# EasyEDA Pro project ProPrj_ftdi-jtag-xilinx-14pin_2025-03-20_v2.1.epro, schematic Schematic1

## Sheets
1 FT2232HQ: Board Name: Board1; Create Date: 2025-03-20; Page Name: FT2232HQ; Project Name: ftdi-jtag-xilinx-14pin; Schematic Name: Schematic1; Update Date: 2025-03-20; Company: 嘉立创EDA; Page Size: A4; Version: V1.0
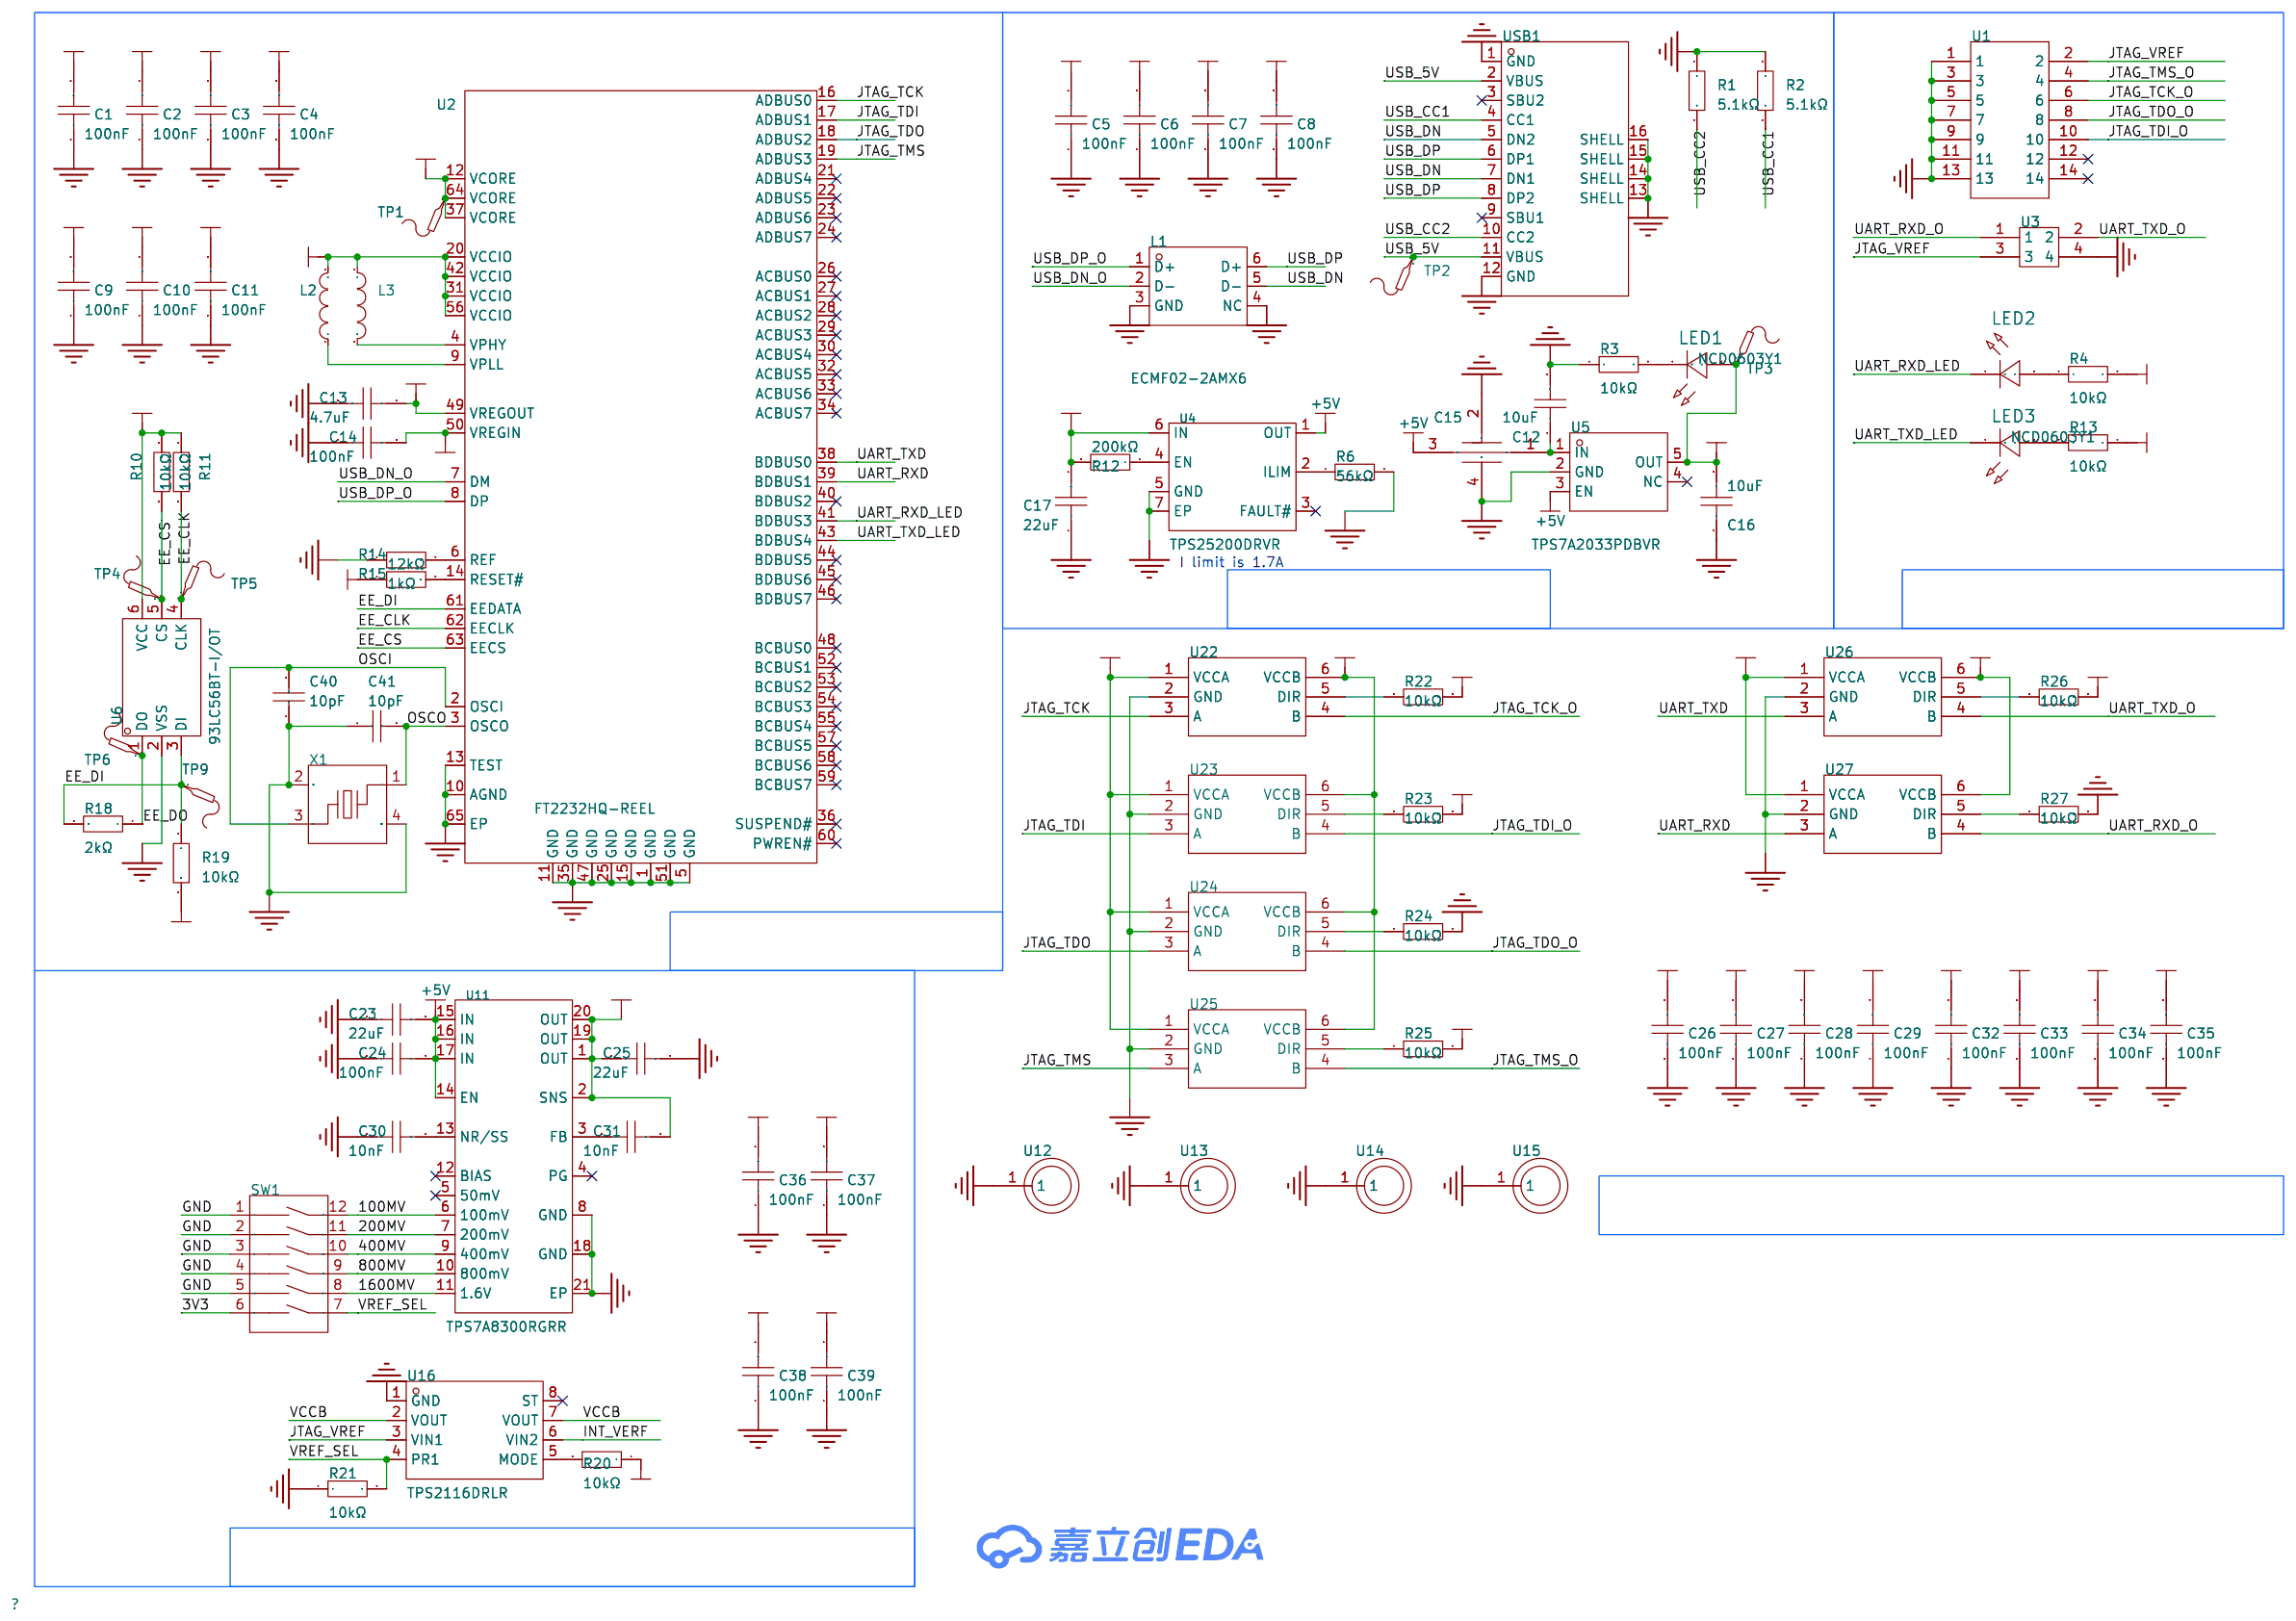
[diagram p0: FT2232HQ]
2 JTAG Adapter: Page Name: JTAG Adapter
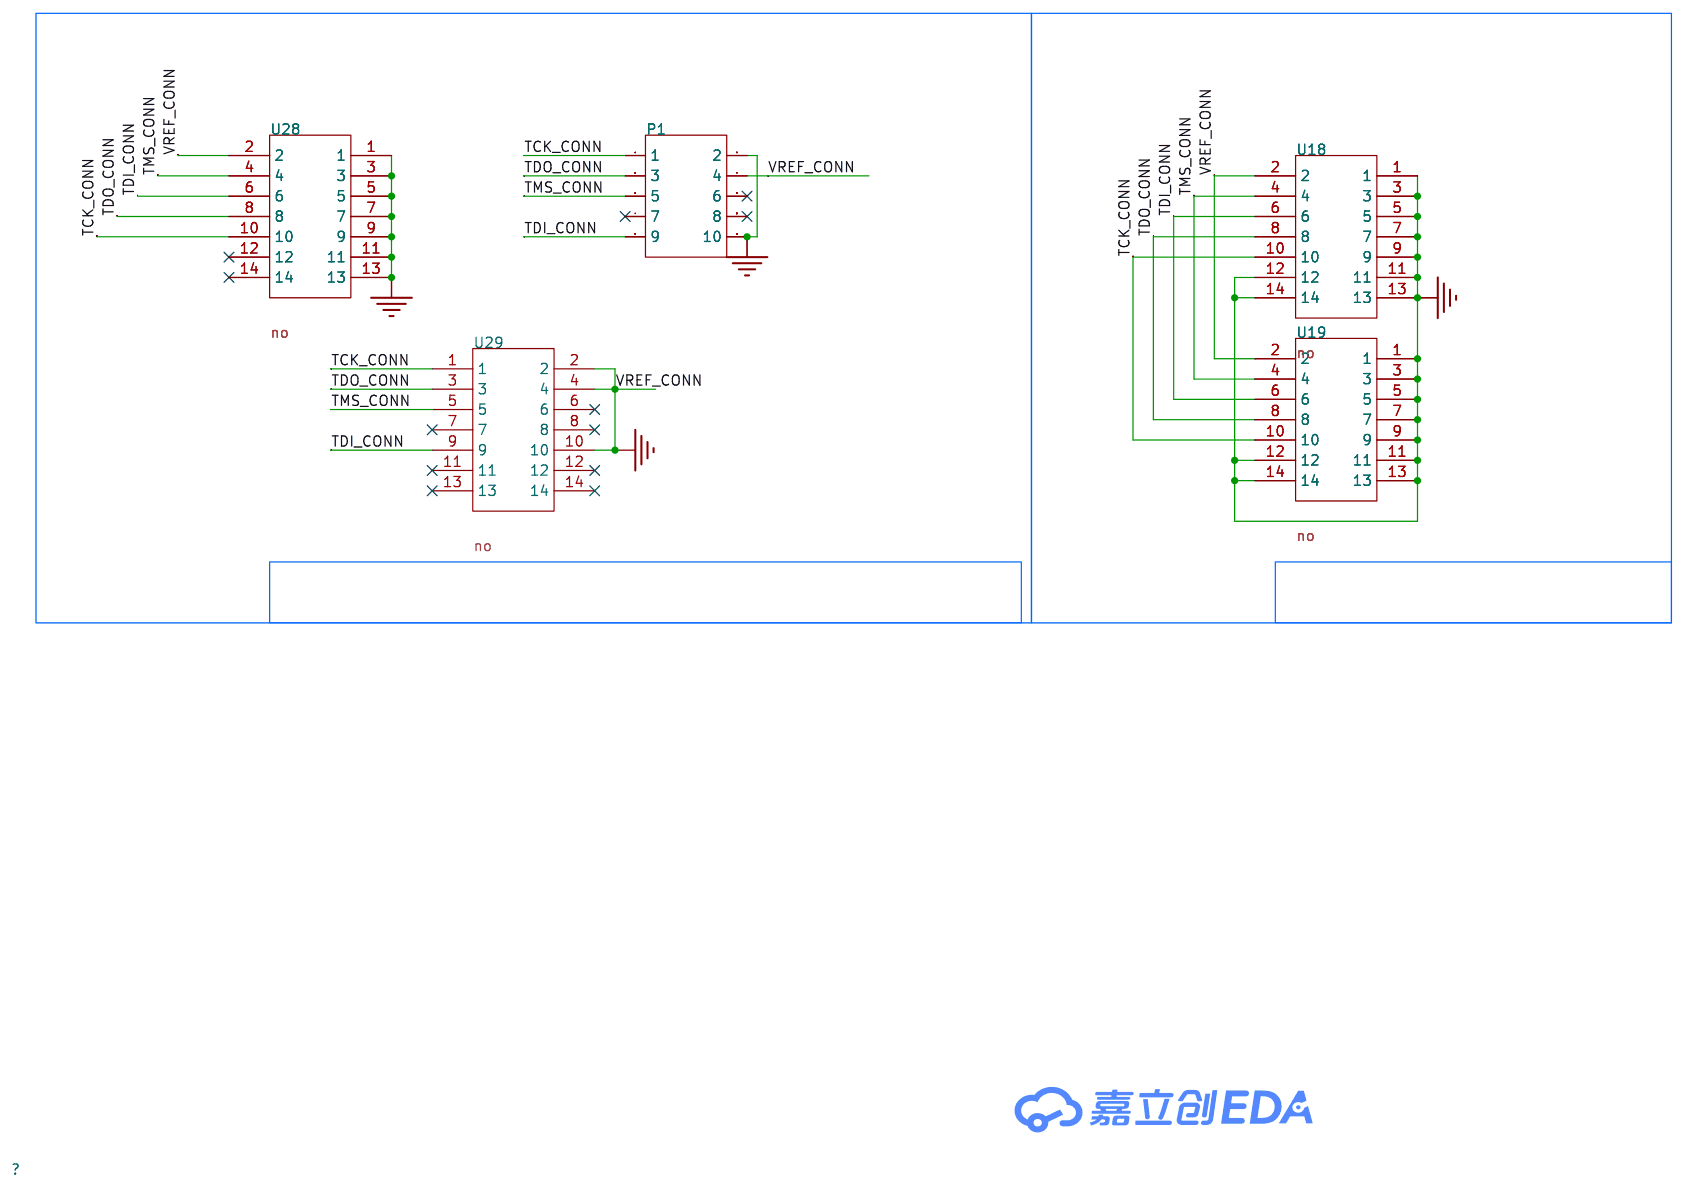
[diagram p1: JTAG Adapter]
3 Overview: Create Date: 2024-12-31; Page Name: Overview; Project Name: ftdi-jtag-xilinx; Update Date: 2024-12-31
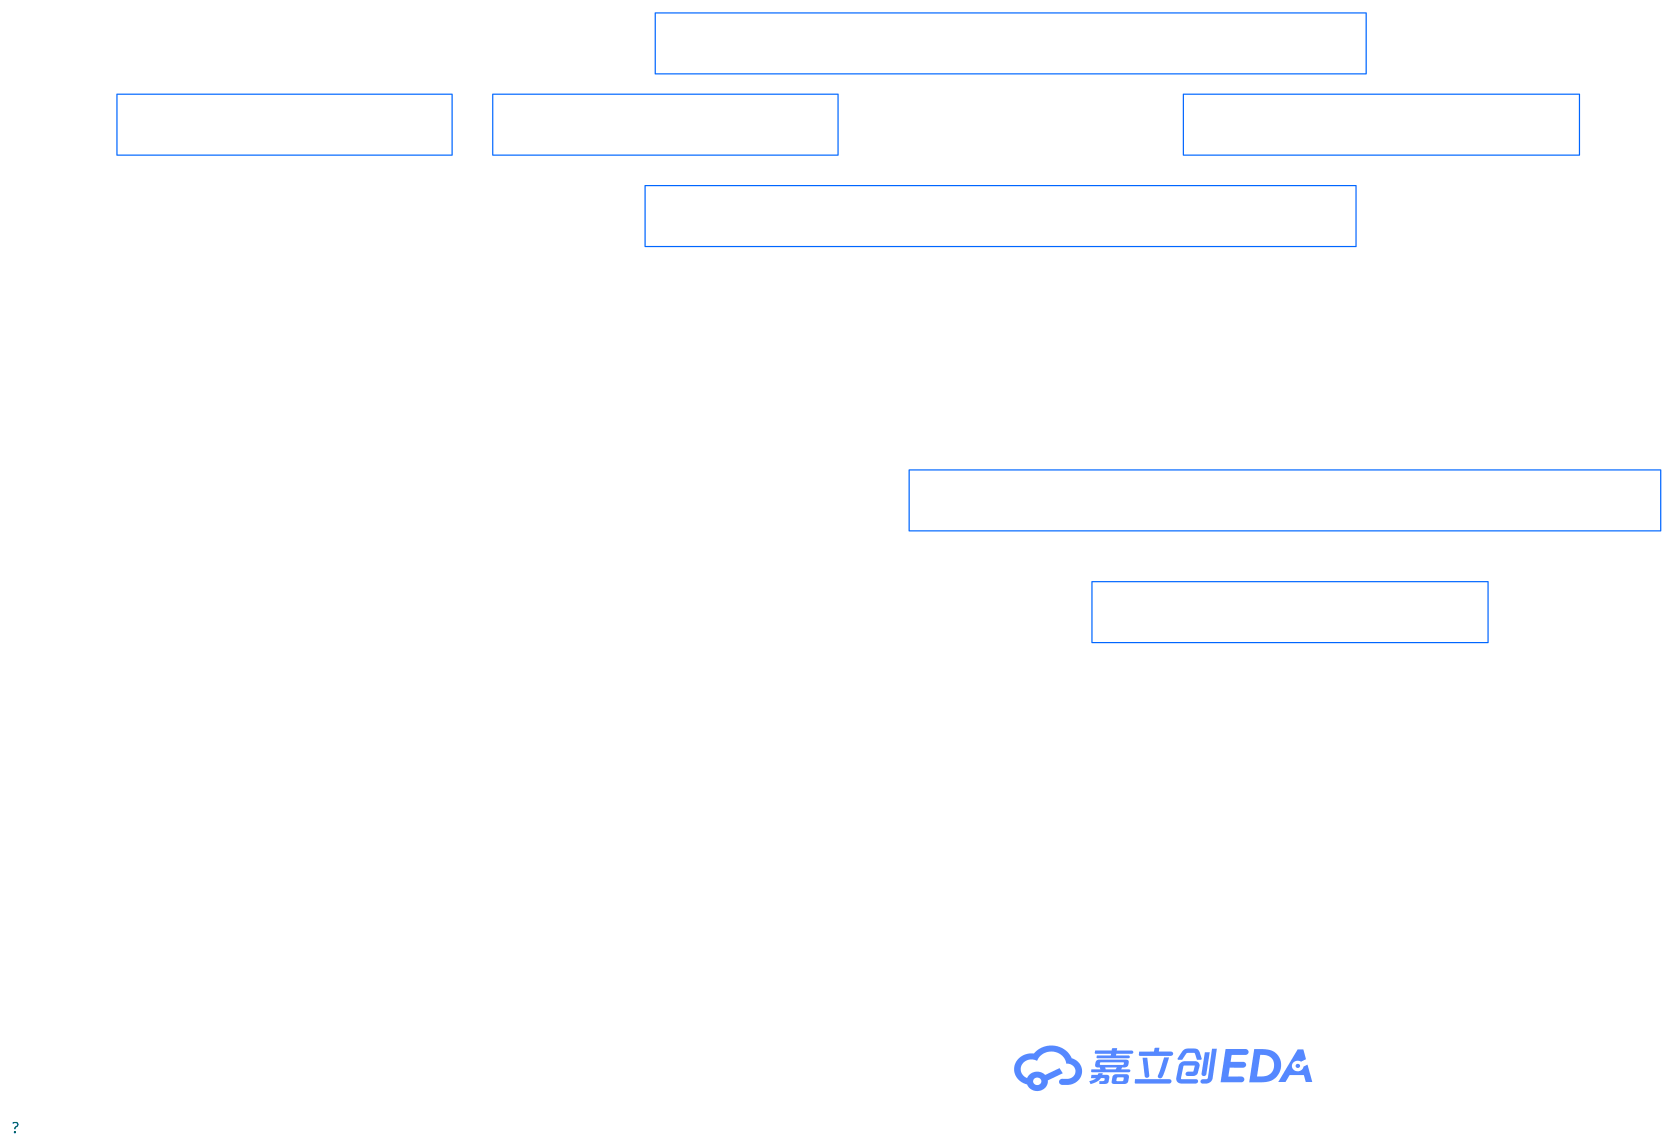
[diagram p2: Overview]
4 TVS: Page Name: TVS
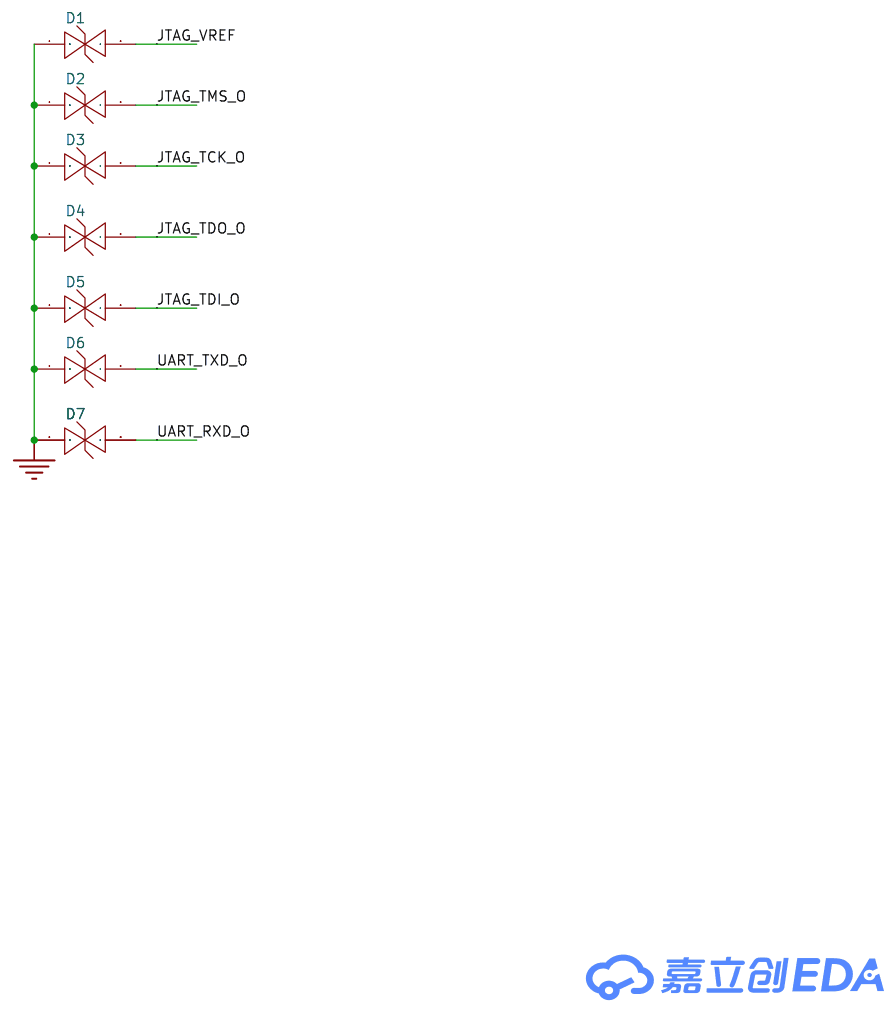
[diagram p3: TVS]

## Parts
sheet FT2232HQ
C1  100nF  [C0402]
C2  100nF  [C0402]
C3  100nF  [C0402]
C4  100nF  [C0402]
C5  100nF  [C0402]
C6  100nF  [C0402]
C7  100nF  [C0402]
C8  100nF  [C0402]
C9  100nF  [C0402]
C10  100nF  [C0402]
C11  100nF  [C0402]
C12  10uF  [C0603]
C13  4.7uF  [C0402]
C14  100nF  [C0402]
C15  NFM21PC104R1E3D  [CAP-SMD_4P-L2.0-W1.25]
C16  10uF  [C0603]
C17  22uF  [C0805]
C23  22uF  [C0805]
C24  100nF  [C0402]
C25  22uF  [C0805]
C26  100nF  [C0402]
C27  100nF  [C0402]
C28  100nF  [C0402]
C29  100nF  [C0402]
C30  10nF  [C0402]
C31  10nF  [C0402]
C32  100nF  [C0402]
C33  100nF  [C0402]
C34  100nF  [C0402]
C35  100nF  [C0402]
C36  100nF  [C0402]
C37  100nF  [C0402]
C38  100nF  [C0402]
C39  100nF  [C0402]
C40  10pF  [C0402]
C41  10pF  [C0402]
L1  ECMF02-2AMX6  [UFQFN-6_L1.7-W1.5]
L2  BLM15PD121SN1D  [L0402]
L3  BLM15PD121SN1D  [L0402]
LED1  NCD0603Y1  [LED0603-RD]
LED2  NCD0603Y1  [LED0603-RD]
LED3  NCD0603Y1  [LED0603-RD]
R1  5.1kΩ  [R0402]
R2  5.1kΩ  [R0402]
R3  10kΩ  [R0402]
R4  10kΩ  [R0402]
R6  56kΩ  [R0402]
R10  10kΩ  [R0402]
R11  10kΩ  [R0402]
R12  200kΩ  [R0402]
R13  10kΩ  [R0402]
R14  12kΩ  [R0402]
R15  1kΩ  [R0402]
R18  2kΩ  [R0402]
R19  10kΩ  [R0402]
R20  10kΩ  [R0402]
R21  10kΩ  [R0402]
R22  10kΩ  [R0402]
R23  10kΩ  [R0402]
R24  10kΩ  [R0402]
R25  10kΩ  [R0402]
R26  10kΩ  [R0402]
R27  10kΩ  [R0402]
SW1  SMQP-06B-TP  [SW-TH_12P-P2.54_SMQP-06B-TP]
TP1  -  [Test-Point-0.5mm]
TP2  -  [Test-Point-0.5mm]
TP3  -  [Test-Point-0.5mm]
TP4  -  [Test-Point-0.5mm]
TP5  -  [Test-Point-0.5mm]
TP6  -  [Test-Point-0.5mm]
TP9  -  [Test-Point-0.5mm]
U1  -  [JTAG_V3]
U2  FT2232HQ-REEL  [QFN-64_L9.0-W9.0-P0.50-TL-EP4.3]
U3  -  [2x2p侧贴排针]
U4  TPS25200DRVR  [WSON-6_L2.0-W2.0-P0.65-TL-EP]
U5  TPS7A2033PDBVR  [SOT-23-5_L2.9-W1.6-P0.95-LS2.8-BR]
U6  93LC56BT-I/OT  [SOT-23-6_L2.9-W1.6-P0.95-LS2.8-BR]
U11  TPS7A8300RGRR  [VQFN-20_L3.5-W3.5-P0.50-BL-EP2.0]
U12  -  [M2焊接螺柱]
U13  -  [M2焊接螺柱]
U14  -  [M2焊接螺柱]
U15  -  [M2焊接螺柱]
U16  TPS2116DRLR  [SOT-583-8_L2.1-W1.6-P0.50-LS1.6-BL]
U22  SN74LVC1T45DBVR  [SOT-23-6_L2.9-W1.6-P0.95-LS2.8-BR]
U23  SN74LVC1T45DBVR  [SOT-23-6_L2.9-W1.6-P0.95-LS2.8-BR]
U24  SN74LVC1T45DBVR  [SOT-23-6_L2.9-W1.6-P0.95-LS2.8-BR]
U25  SN74LVC1T45DBVR  [SOT-23-6_L2.9-W1.6-P0.95-LS2.8-BR]
U26  SN74LVC1T45DBVR  [SOT-23-6_L2.9-W1.6-P0.95-LS2.8-BR]
U27  SN74LVC1T45DBVR  [SOT-23-6_L2.9-W1.6-P0.95-LS2.8-BR]
USB1  TYPEC-302-BRP16SC16  [USB-C-SMD_TYPEC-302-BRP16SC16]
X1  12MHz  [CRYSTAL-SMD_4P-L2.5-W2.0-BL-A]
sheet JTAG Adapter
P1  2.54-2*5P简牛  [IDC-TH_10P-P2.54_C5665]
U18  -  [JTAG_V3]
U19  -  [JTAG_V3]
U28  -  [JTAG_V3]
U29  -  [JTAG_V3]
sheet TVS
D1  H5VL10B  [SOD-882_L1.0-W0.6-BI]
D2  H5VL10B  [SOD-882_L1.0-W0.6-BI]
D3  H5VL10B  [SOD-882_L1.0-W0.6-BI]
D4  H5VL10B  [SOD-882_L1.0-W0.6-BI]
D5  H5VL10B  [SOD-882_L1.0-W0.6-BI]
D6  H5VL10B  [SOD-882_L1.0-W0.6-BI]
D7  H5VL10B  [SOD-882_L1.0-W0.6-BI]

## Library data of the parts
C1-C11 C14 C24 C26-C29 C32-C39 = CC0402KRX7R7BB104: 容值:100nF;精度:±10%;额定电压:16V;材质(温度系数):X7R;; LCSC Part Name: 100nF ±10% 16V; Supplier Part: C60474; Manufacturer: YAGEO(国巨); Supplier Footprint: 0402; JLCPCB Part Class: Extended Part; Datasheet: https://atta.szlcsc.com/upload/public/pdf/source/20211223/9278FD768280B81DDBEF48FA36411A03.pdf; Supplier: LCSC; Tolerance: ±10%; Voltage Rated: 16V; Temperature Coefficient: X7R
C12 C16 = CL10A106MA8NRNC: 容值:10uF;精度:±20%;额定电压:25V;材质(温度系数):X5R;; LCSC Part Name: 10uF ±20% 25V; Supplier Part: C96446; Manufacturer: SAMSUNG(三星); Supplier Footprint: 0603; JLCPCB Part Class: Basic Part; Datasheet: https://atta.szlcsc.com/upload/public/pdf/source/20160218/1457707763339.pdf; Supplier: LCSC; Tolerance: ±20%; Voltage Rated: 25V; Temperature Coefficient: X5R
C13 = CL05A475KP5NRNC: 容值:4.7uF;精度:±10%;额定电压:10V;材质(温度系数):X5R;; LCSC Part Name: 4.7uF ±10% 10V; Supplier Part: C368809; Manufacturer: SAMSUNG(三星); Supplier Footprint: 0402; JLCPCB Part Class: Extended Part; Datasheet: https://atta.szlcsc.com/upload/public/pdf/source/20160218/1457707763339.pdf; Supplier: LCSC; Tolerance: ±10%; Voltage Rated: 10V; Temperature Coefficient: X5R
C15 = NFM21PC104R1E3D: 电容量:100nF;精度:±20%;直流电阻:30mΩ;; LCSC Part Name: 100nF(104) ±20% 25V; Supplier Part: C86150; Manufacturer: muRata(村田); Supplier Footprint: 0805; JLCPCB Part Class: 扩展库; Datasheet: https://atta.szlcsc.com/upload/public/pdf/source/20180326/C86150_E4B7366323682FA84DED9003C68CA797.pdf; Supplier: LCSC; Nominal Capacitance: 100nF; CapacitanceTolerance: ±20%; DC Rated Voltage: 25V; Rated Current: 2A; DC Resistance: 30mΩ; Operating Temperature: -55℃~+125℃
C17 C23 C25 = CGA0805X5R226M350MT: 容值:22uF;精度:±20%;额定电压:35V;材质(温度系数):X5R;; LCSC Part Name: 22uF ±20% 35V; Supplier Part: C6119901; Manufacturer: HRE(芯声); Supplier Footprint: 0805; JLCPCB Part Class: Extended Part; Datasheet: https://atta.szlcsc.com/upload/public/pdf/source/20231129/D589D0CC4D260F7AC3A77E53B455CCB3.pdf; Supplier: LCSC; Tolerance: ±20%; Voltage Rated: 35V; Temperature Coefficient: X5R
C30 C31 = CC0402KRX7R9BB103: 容值:10nF;精度:±10%;额定电压:50V;材质(温度系数):X7R;; LCSC Part Name: 10nF ±10% 50V; Supplier Part: C60133; Manufacturer: YAGEO(国巨); Supplier Footprint: 0402; JLCPCB Part Class: Extended Part; Datasheet: https://atta.szlcsc.com/upload/public/pdf/source/20180224/C181747_15194369449651363981.pdf; Supplier: LCSC; Tolerance: ±10%; Voltage Rated: 50V; Temperature Coefficient: X7R
C40 C41 = CC0402JRNPO9BN100: 容值:10pF;精度:±5%;额定电压:50V;材质(温度系数):NP0;; LCSC Part Name: 10pF ±5% 50V; Supplier Part: C106199; Manufacturer: YAGEO(国巨); Supplier Footprint: 0402; JLCPCB Part Class: 扩展库; Datasheet: https://atta.szlcsc.com/upload/public/pdf/source/20181008/C309499_21CC21451B82C39E3D92150FD6B30293.pdf; Supplier: LCSC; Tolerance: ±5%; Voltage Rated: 50V; Temperature Coefficient: NP0
L1 = ECMF02-2AMX6: 线路数:2;直流电阻(DCR):2.5Ω;; Supplier Part: C2651144; Manufacturer: ST(意法半导体); Supplier Footprint: UFQFN-6(1.5x1.7); JLCPCB Part Class: 扩展库; Datasheet: https://atta.szlcsc.com/upload/public/pdf/source/20210702/5ABAEB64ABBB5666ADAF5B85EB7C19E4.pdf; Supplier: LCSC; Number of Lines: 2; Current Rating: 200mA; DC Resistance (DCR): 2.5Ω; Operating Temperature: -40℃~+85℃
L2 L3 = BLM15PD121SN1D: 标称阻抗@测试频率:120Ω@100MHz;误差:±25%;直流电阻(RDC):90mΩ;; LCSC Part Name: 单路 0402磁珠 阻抗120Ω@100MHz; Supplier Part: C76891; Manufacturer: muRata(村田); Supplier Footprint: 0402; Datasheet: https://atta.szlcsc.com/upload/public/pdf/source/20180326/C76891_C89C2C1119D9992B67A2515C9BBB882D.pdf; Supplier: LCSC; Impedance @ Frequency: 120Ω@100MHz; Tolerance: ±25%; DC Resistance: 90mΩ; Current Rating: 1.3A; Circuits: 1
LED1-LED3 = NCD0603Y1: 发光颜色:黄色;正向电压(VF):1.6V~2.6V;功率:65mW;正向电流:20mA;主波长:586nm~595nm;透镜颜色:无色透明透镜;发光强度:80mcd~220mcd;发光角度:130°;工作温度:-30℃~+85℃;; Supplier Part: C84268; Manufacturer: 国星光电; Supplier Footprint: 0603; JLCPCB Part Class: Extended Part; Datasheet: https://atta.szlcsc.com/upload/public/pdf/source/20200820/C84268_8FC106CB292CF978F9CFC6892464F83C.pdf; Supplier: LCSC; Emitted Color: 黄色; Forward Voltage (VF): 1.6V~2.6V; Power Dissipation: 65mW; Forward Current: 20mA; Dominant Wavelength: 586nm~595nm; Lens Color: 无色透明透镜; Luminous Intensity: 80mcd~220mcd; Viewing Angle: 130°; Operating Temperature: -30℃~+85℃
R1 R2 = 0402WGF5101TCE: 电阻类型:厚膜电阻;阻值:5.1kΩ;精度:±1%;功率:62.5mW;最大工作电压:50V;温度系数:±100ppm/℃;; LCSC Part Name: 5.1kΩ ±1% 62.5mW 厚膜电阻; Supplier Part: C25905; Manufacturer: UNI-ROYAL(厚声); Supplier Footprint: 0402; JLCPCB Part Class: Basic Part; Datasheet: https://atta.szlcsc.com/upload/public/pdf/source/20200306/C422600_1E6D84923E4A46A82E41ADD87F860B5C.pdf; Supplier: LCSC; Type: 厚膜电阻; Tolerance: ±1%; Power(Watts): 62.5mW; Overload Voltage (Max): 50V; Temperature Coefficient: ±100ppm/℃; Operating Temperature Range: -55℃~+155℃
R3 R4 R10 R11 R13 R19-R27 = RC0402FR-0710KL: 电阻类型:厚膜电阻;阻值:10kΩ;精度:±1%;功率:62.5mW;最大工作电压:50V;温度系数:±100ppm/℃;; LCSC Part Name: 厚膜电阻 10kΩ ±1% 62.5mW; Supplier Part: C60490; Manufacturer: YAGEO(国巨); Supplier Footprint: 0402; JLCPCB Part Class: Extended Part; Datasheet: https://atta.szlcsc.com/upload/public/pdf/source/20170925/C131467_1506321478108990263.pdf; Supplier: LCSC; Type: 厚膜电阻; Tolerance: ±1%; Power(Watts): 62.5mW; Overload Voltage (Max): 50V; Temperature Coefficient: ±100ppm/℃; Operating Temperature Range: -55℃~+155℃
R6 = 0402WGF5602TCE: 电阻类型:厚膜电阻;阻值:56kΩ;精度:±1%;功率:62.5mW;最大工作电压:50V;温度系数:±100ppm/℃;; LCSC Part Name: 56kΩ ±1% 62.5mW 厚膜电阻; Supplier Part: C25796; Manufacturer: UNI-ROYAL(厚声); Supplier Footprint: 0402; JLCPCB Part Class: Extended Part; Datasheet: https://atta.szlcsc.com/upload/public/pdf/source/20200306/C422600_1E6D84923E4A46A82E41ADD87F860B5C.pdf; Supplier: LCSC; Type: 厚膜电阻; Tolerance: ±1%; Power(Watts): 62.5mW; Overload Voltage (Max): 50V; Temperature Coefficient: ±100ppm/℃; Operating Temperature Range: -55℃~+155℃
R12 = 0402WGF2003TCE: 电阻类型:厚膜电阻;阻值:200kΩ;精度:±1%;功率:62.5mW;最大工作电压:50V;温度系数:±100ppm/℃;; LCSC Part Name: 200kΩ ±1% 62.5mW 厚膜电阻; Supplier Part: C25764; Manufacturer: UNI-ROYAL(厚声); Supplier Footprint: 0402; JLCPCB Part Class: Basic Part; Datasheet: https://atta.szlcsc.com/upload/public/pdf/source/20200306/C422600_1E6D84923E4A46A82E41ADD87F860B5C.pdf; Supplier: LCSC; Type: 厚膜电阻; Tolerance: ±1%; Power(Watts): 62.5mW; Overload Voltage (Max): 50V; Temperature Coefficient: ±100ppm/℃; Operating Temperature Range: -55℃~+155℃
R14 = 0402WGF1202TCE: 电阻类型:厚膜电阻;阻值:12kΩ;精度:±1%;功率:62.5mW;最大工作电压:50V;温度系数:±100ppm/℃;; LCSC Part Name: 12kΩ ±1% 62.5mW 厚膜电阻; Supplier Part: C25752; Manufacturer: UNI-ROYAL(厚声); Supplier Footprint: 0402; JLCPCB Part Class: Basic Part; Datasheet: https://atta.szlcsc.com/upload/public/pdf/source/20200306/C422600_1E6D84923E4A46A82E41ADD87F860B5C.pdf; Supplier: LCSC; Type: 厚膜电阻; Tolerance: ±1%; Power(Watts): 62.5mW; Overload Voltage (Max): 50V; Temperature Coefficient: ±100ppm/℃; Operating Temperature Range: -55℃~+155℃
R15 = 0402WGF1001TCE: 电阻类型:厚膜电阻;阻值:1kΩ;精度:±1%;功率:62.5mW;最大工作电压:50V;温度系数:±100ppm/℃;; LCSC Part Name: 1kΩ ±1% 62.5mW 厚膜电阻; Supplier Part: C11702; Manufacturer: UNI-ROYAL(厚声); Supplier Footprint: 0402; JLCPCB Part Class: Basic Part; Datasheet: https://atta.szlcsc.com/upload/public/pdf/source/20200306/C422600_1E6D84923E4A46A82E41ADD87F860B5C.pdf; Supplier: LCSC; Type: 厚膜电阻; Tolerance: ±1%; Power(Watts): 62.5mW; Overload Voltage (Max): 50V; Temperature Coefficient: ±100ppm/℃; Operating Temperature Range: -55℃~+155℃
R18 = FRC0402F2001TS: 电阻类型:厚膜电阻;阻值:2kΩ;精度:±1%;功率:62.5mW;最大工作电压:50V;温度系数:±100ppm/℃;; LCSC Part Name: 2kΩ ±1% 62.5mW 厚膜电阻; Supplier Part: C2909344; Manufacturer: FOJAN(富捷); Supplier Footprint: 0402; JLCPCB Part Class: Extended Part; Datasheet: https://atta.szlcsc.com/upload/public/pdf/source/20211221/925EC7D7225764EE0046F22065062C87.pdf; Supplier: LCSC; Type: 厚膜电阻; Tolerance: ±1%; Power(Watts): 62.5mW; Overload Voltage (Max): 50V; Temperature Coefficient: ±100ppm/℃; Operating Temperature Range: -55℃~+155℃
SW1 = SMQP-06B-TP: 类型:琴键;电路结构:-;开关位数:6位;额定电流:25mA;额定电压:24V;使用寿命:5千次;颜色:蓝色;; LCSC Part Name: 间距2.54mm 琴键6位拨码开关; Supplier Part: C5299496; Manufacturer: SM Switch; JLCPCB Part Class: 扩展库; Datasheet: https://atta.szlcsc.com/upload/public/pdf/source/20230428/70B55ED7BA6FDEB5D2D5B22165FF4512.pdf; Supplier: LCSC; Type: 琴键; Number of Positions: 6位; Lead Pitch: 2.54mm; Current Rating: 25mA; Voltage Rating: 24V; Operating Temperature: -40℃~+85℃; Operating Life: 5千次; Color: 蓝色
TP1-TP6 TP9 = Test-Point: Test Point 测试点; Check: false
U1 U18 U19 U28 U29 = jtagv4: Check: false
U2 = FT2232HQ-REEL: 应用功能:USB转UART；USB转FIFO;接口协议:UART;供电电压:3V~3.6V;; Supplier Part: C193662; Manufacturer: FTDI(飞特帝亚); Supplier Footprint: QFN-64-EP(9x9); JLCPCB Part Class: 扩展库; Datasheet: https://atta.szlcsc.com/upload/public/pdf/source/20180530/C193662_F14B45A4B5271BE746E436B0F2E041EE.pdf; Supplier: LCSC; Applications Function: USB转UART；USB转FIFO; Protocol: UART; Supply Voltage: 3V~3.6V; Operating Temperature: -40℃~+85℃
U3 = 2: Check: false
U4 = TPS25200DRVR: TPS25200 具有过压钳位的 6.5V/2.8A 电子保险丝; Supplier: LCSC; Manufacturer: TI(德州仪器); Supplier Part: C128401; JLCPCB Part Class: 扩展库; Supplier Footprint: WSON-6-EP(2x2); Datasheet: https://www.ti.com/cn/lit/gpn/tps25200
U5 = TPS7A2033PDBVR: Supplier Part: C2862740; Manufacturer: TI(德州仪器); Supplier Footprint: SOT-23-5; JLCPCB Part Class: 扩展库; Datasheet: https://atta.szlcsc.com/upload/public/pdf/source/20230221/9B73099824E408F4B24BD95C528A27ED.pdf; Supplier: LCSC
U6 = 93LC56BT-I/OT: The Microchip 93LC56B device is a 2Kb Microwire (3-wire) Serial EEPROM with dedicated 16-bit memory organization and a voltage operation range of 2.5 - 5.5V.? Also available are the 93LC56A for dedicated 8-bit memory organization and the 93LC56C for hardw; Supplier Part: C190271; Manufacturer: MICROCHIP(美国微芯); Supplier Footprint: SOT-23-6; Datasheet: https://atta.szlcsc.com/upload/public/pdf/source/20180423/C190271_ABAD329DACFE2165969EA1B02E3F54C8.pdf; Supplier: LCSC
U11 = TPS7A8300RGRR: 输出类型:-;; Supplier: LCSC; Supplier Part: C544500; Manufacturer: TI(德州仪器); JLCPCB Part Class: 扩展库; Supplier Footprint: VQFN-20-EP(3.5x3.5); Datasheet: https://www.ti.com/cn/lit/gpn/tps7a8300
U12-U15 = M2焊接螺柱: Check: false
U16 = TPS2116DRLR: 通道数:1;输出电流:2.5A;输入电压:1.6V~5.5V;导通电阻:42mΩ;; Supplier Part: C3235557; Manufacturer: TI(德州仪器); Supplier Footprint: SOT-583; JLCPCB Part Class: 扩展库; Datasheet: https://www.ti.com/cn/lit/gpn/tps2116; Supplier: LCSC; Number of Outputs: 1; Output Current: 2.5A; Input Voltage: 1.6V~5.5V; Resistor On-State: 42mΩ; Operating Temperature	-: -40℃~+105℃
U22-U27 = SN74LVC1T45DBVR: 数据速率:420Mbps;电压(VCCA):1.65V~5.5V;电压(VCCB):1.65V~5.5V;电路数:1;每个电路通道数:1;; Supplier Part: C7843; Manufacturer: TI(德州仪器); Supplier Footprint: SOT-23-6; JLCPCB Part Class: 扩展库; Datasheet: https://www.ti.com/cn/lit/gpn/sn74lvc1t45; Supplier: LCSC; Channel Type: 双向; Data Rate: 420Mbps; Supply Voltage (VCCA): 1.65V~5.5V; Supply Voltage (VCCB): 1.65V~5.5V; Number of Circuits: 1; Channels per Circuit: 1; Output Type: 非反相；三态; Operating Temperature: -40℃~+85℃
USB1 = TYPEC-302-BRP16SC16: 连接器类型:Type-C;标准:USB 3.1;公母:母;端口数量:1;触点数量:16P;安装方式:沉板;额定电流 - 电源:5A;工作温度范围:-45℃~+85℃;焊接温度(最大值):260℃;; LCSC Part Name: Type-C 母 沉板; Supplier Part: C2835313; Manufacturer: XUNPU(讯普); Supplier Footprint: SMD; JLCPCB Part Class: 扩展库; Datasheet: https://atta.szlcsc.com/upload/public/pdf/source/20210629/C2835313_96CAAD9C15DFF4F1D03DDC0B4E6AD92A.pdf; Supplier: LCSC; Connector Type: Type-C; Standard: USB 3.1; Gender: 母; Number of Ports: 1; Number of Contacts: 16P; Mounting Style: 沉板; Current Rating - Power (Max): 5A; Operating Temperature Range: -45℃~+85℃; Soldering Temperature(Max): 260℃
X1 = X252012MMB4SI-24: 晶振类型:贴片晶振;频率:12MHz;常温频差:±10ppm;负载电容:10pF;频率稳定度:±20ppm;; LCSC Part Name: 12MHz ±10ppm 10pF; Supplier Part: C2896601; Manufacturer: YXC(扬兴晶振); Supplier Footprint: SMD2520-4P; Datasheet: https://atta.szlcsc.com/upload/public/pdf/source/20240329/8B53C0AFBC5BB264DFB5D72B3757797A.pdf; Supplier: LCSC; Type: 贴片晶振; Normal temperature Frequency Tolerance: ±10ppm; Load Capacitance: 10pF; Frequency Stability: ±20ppm; Operating Temperature: -40℃~+85℃
P1 = 2.54-2*5P简牛: 连接器类型:简牛座;间距:2.54mm;结构:2x5P;封装形式:直插;行距:2.54mm;排数:2;每排PIN数:5;触头材质:-;触头镀层:-;; LCSC Part Name: 2.54mm 2x5P 排数:2 每排P数:5; Supplier Part: C5665; Manufacturer: BOOMELE(博穆精密); Supplier Footprint: 插件,P=2.54mm; JLCPCB Part Class: 扩展库; Datasheet: https://atta.szlcsc.com/upload/public/pdf/source/20140331/1457707037896.pdf; Supplier: LCSC; Connector Type: 简牛座; Pitch: 2.54mm; Structure: 2x5P; Holder Type: 直插; Row Spacing: 2.54mm; Number of Rows: 2; Pin Number in each Row: 5
D1-D7 = H5VL10B: 极性:双向;反向截止电压(Vrwm):5V;最大钳位电压:10V;峰值脉冲电流(Ipp):5A;峰值脉冲功率(Ppp):50W;击穿电压:5.6V;; LCSC Part Name: H5VL10B 丝印 PB; Supplier Part: C7420372; Manufacturer: 宏迦橙; Supplier Footprint: DFN1006-2L; JLCPCB Part Class: 扩展库; Datasheet: https://atta.szlcsc.com/upload/public/pdf/source/20230630/5024ECFEAD3C9801B07A8DBB967AB462.pdf; Supplier: LCSC; polarity: 双向; Reverse Stand-Off Voltage (Vrwm): 5V; Maximum Clamping Voltage: 10V; Peak Pulse Current (Ipp): 5A; Peak Pulse Power Dissipation (Ppp): 50W; Breakdown Voltage: 5.6V; Reverse Leakage Current (Ir): 100nA; Number of Lines: 单路; Operating Temperature: -55℃~+155℃; Type: ESD

## Nets
3V3: C1.2 C2.2 C3.2 C4.2 C5.2 C6.2 C8.2 C14.2 C16.2 C26.2 C27.2 C32.2 C34.2 C36.2 C38.2 L2.2 L3.1 LED1.2(A) R4.2 R10.1 R11.1 R13.1 R15.1 R19.2 R20.1 R22.2 R23.2 R25.2 R26.2 SW1.6 TP3.1 U2.20(VCCIO) U2.31(VCCIO) U2.42(VCCIO) U2.50(VREGIN) U2.56(VCCIO) U5.5(OUT) U6.6(VCC) U22.1(VCCA) U23.1(VCCA) U24.1(VCCA) U25.1(VCCA) U26.1(VCCA) U27.1(VCCA)
+5V: C15.3(OUT) C23.2 C24.1 U4.1(OUT) U5.3(EN) U11.14(EN) U11.15(IN) U11.16(IN) U11.17(IN)
GND: C1.1 C2.1 C3.1 C4.1 C5.1 C6.1 C7.1 C8.1 C9.1 C10.1 C11.1 C12.2 C13.2 C14.1 C15.2(GND) C15.4(GND) C16.1 C17.1 C23.1 C24.2 C25.2 C26.1 C27.1 C28.1 C29.1 C30.2 C32.1 C33.1 C34.1 C35.1 C36.1 C37.1 C38.1 C39.1 C40.1 C41.1 D1.1(C) D2.1(C) D3.1(C) D4.1(C) D5.1(C) D6.1(C) D7.1(C) L1.3(GND) L1.4(NC) P1.2 P1.10 R1.1 R2.1 R3.1 R6.2 R14.1 R21.1 R24.2 R27.2 SW1.1 SW1.2 SW1.3 SW1.4 SW1.5 U1.1 U1.3 U1.5 U1.7 U1.9 U1.11 U1.13 U2.1(GND) U2.5(GND) U2.10(AGND) U2.11(GND) U2.13(TEST) U2.15(GND) U2.25(GND) U2.35(GND) U2.47(GND) U2.51(GND) U2.65(EP) U3.4 U4.5(GND) U4.7(EP) U5.2(GND) U6.2(VSS) U11.8(GND) U11.18(GND) U11.21(EP) U12.1 U13.1 U14.1 U15.1 U16.1(GND) U18.1 U18.3 U18.5 U18.7 U18.9 U18.11 U18.12 U18.13 U18.14 U19.1 U19.3 U19.5 U19.7 U19.9 U19.11 U19.12 U19.13 U19.14 U22.2(GND) U23.2(GND) U24.2(GND) U25.2(GND) U26.2(GND) U27.2(GND) U28.1 U28.3 U28.5 U28.7 U28.9 U28.11 U28.13 U29.2 U29.10 USB1.1(GND) USB1.12(GND) USB1.13(SHELL) USB1.14(SHELL) USB1.15(SHELL) USB1.16(SHELL) X1.2(GND) X1.4(GND)
VCCB: C7.2 C28.2 C29.2 C33.2 C35.2 C37.2 C39.2 U16.2(VOUT) U16.7(VOUT) U22.6(VCCB) U23.6(VCCB) U24.6(VCCB) U25.6(VCCB) U26.6(VCCB) U27.6(VCCB)
100MV: SW1.12 U11.6(100mV)
200MV: SW1.11 U11.7(200mV)
400MV: SW1.10 U11.9(400mV)
800MV: SW1.9 U11.10(800mV)
1600MV: SW1.8 U11.11(1.6V)
EE_CLK: R11.2 TP5.1 U2.62(EECLK) U6.4(CLK)
EE_CS: R10.2 TP4.1 U2.63(EECS) U6.5(CS)
EE_DI: R18.2 R19.1 TP9.1 U2.61(EEDATA) U6.3(DI)
EE_DO: R18.1 TP6.1 U6.1(DO)
INT_VERF: C25.1 C31.1 U11.1(OUT) U11.2(SNS) U11.19(OUT) U11.20(OUT) U16.6(VIN2)
JTAG_TCK: U2.16(ADBUS0) U22.3(A)
JTAG_TCK_O: D3.2(A) U1.6 U22.4(B)
JTAG_TDI: U2.17(ADBUS1) U23.3(A)
JTAG_TDI_O: D5.2(A) U1.10 U23.4(B)
JTAG_TDO: U2.18(ADBUS2) U24.3(A)
JTAG_TDO_O: D4.2(A) U1.8 U24.4(B)
JTAG_TMS: U2.19(ADBUS3) U25.3(A)
JTAG_TMS_O: D2.2(A) U1.4 U25.4(B)
JTAG_VREF: D1.2(A) U1.2 U3.3 U16.3(VIN1)
OSCI: C40.2 U2.2(OSCI) X1.3
OSCO: C41.2 U2.3(OSCO) X1.1
TCK_CONN: P1.1 U18.10 U19.10 U28.10 U29.1
TDI_CONN: P1.9 U18.6 U19.6 U28.6 U29.9
TDO_CONN: P1.3 U18.8 U19.8 U28.8 U29.3
TMS_CONN: P1.5 U18.4 U19.4 U28.4 U29.5
UART_RXD: U2.39(BDBUS1) U27.3(A)
UART_RXD_LED: LED2.1(C) U2.41(BDBUS3)
UART_RXD_O: D7.2(A) U3.1 U27.4(B)
UART_TXD: U2.38(BDBUS0) U26.3(A)
UART_TXD_LED: LED3.1(C) U2.43(BDBUS4)
UART_TXD_O: D6.2(A) U3.2 U26.4(B)
USB_5V: C17.2 R12.2 TP2.1 U4.6(IN) USB1.2(VBUS) USB1.11(VBUS)
USB_CC1: R2.2 USB1.4(CC1)
USB_CC2: R1.2 USB1.10(CC2)
USB_DN: L1.5(D-) USB1.5(DN2) USB1.7(DN1)
USB_DN_O: L1.2(D-) U2.7(DM)
USB_DP: L1.6(D+) USB1.6(DP1) USB1.8(DP2)
USB_DP_O: L1.1(D+) U2.8(DP)
VCORE: C9.2 C10.2 C11.2 C13.1 TP1.1 U2.12(VCORE) U2.37(VCORE) U2.49(VREGOUT) U2.64(VCORE)
VREF_CONN: P1.4 U18.2 U19.2 U28.2 U29.4
VREF_SEL: R21.2 SW1.7 U16.4(PR1)
$1N3333: L3.2 U2.4(VPHY)
$1N3334: L2.1 U2.9(VPLL)
$1N3341: R14.2 U2.6(REF)
$1N3343: R15.2 U2.14(RESET#)
$1N3498: R20.2 U16.5(MODE)
$1N3540: R12.1 U4.4(EN)
$1N3543: R6.1 U4.2(ILIM)
$1N3546: C12.1 C15.1(IN) U5.1(IN)
$1N3571: C30.1 U11.13(NR/SS)
$1N3574: C31.2 U11.3(FB)
$1N4563: LED1.1(C) R3.2
$1N7583: LED3.2(A) R13.2
$1N18705: R22.1 U22.5(DIR)
$1N18713: R23.1 U23.5(DIR)
$1N18716: R25.1 U25.5(DIR)
$1N19227: R26.1 U26.5(DIR)
$1N19229: R27.1 U27.5(DIR)
$1N19829: R24.1 U24.5(DIR)
$1N22625: LED2.2(A) R4.1

Not connected (* = marked no-connect by the designer): P1 6* 7* 8*; U1 12* 14*; U2 21(ADBUS4)* 22(ADBUS5)* 23(ADBUS6)* 24(ADBUS7)* 26(ACBUS0)* 27(ACBUS1)* 28(ACBUS2)* 29(ACBUS3)* 30(ACBUS4)* 32(ACBUS5)* 33(ACBUS6)* 34(ACBUS7)* 36(SUSPEND#)* 40(BDBUS2)* 44(BDBUS5)* 45(BDBUS6)* 46(BDBUS7)* 48(BCBUS0)* 52(BCBUS1)* 53(BCBUS2)* 54(BCBUS3)* 55(BCBUS4)* 57(BCBUS5)* 58(BCBUS6)* 59(BCBUS7)* 60(PWREN#)*; U4 3(FAULT#)*; U5 4(NC)*; U11 4(PG)* 5(50mV)* 12(BIAS)*; U16 8(ST)*; U28 12* 14*; U29 6* 7* 8* 11* 12* 13* 14*; USB1 3(SBU2)* 9(SBU1)*

## Notes on the sheets
sheet 1
- I limit is 1.7A
- USB & 3V3
- JTAG & UART
- FT2232HQ
- LEVEL SHIFTER & RESET
- VOLTAGE LEVEL SWITCH
sheet 2
- 14PIN to 10PIN
- 14PIN to 14PIN
sheet 3
- LEVEL SHIFTER & RESET
- USB & 3V3
- FT2232HQ
- JTAG & UART
- VOLTAGE LEVEL SWITCH
- 14PIN to (6PIN + UART)
- 14PIN to 14PIN
